# Altium project MACH_THU.PrjPCB
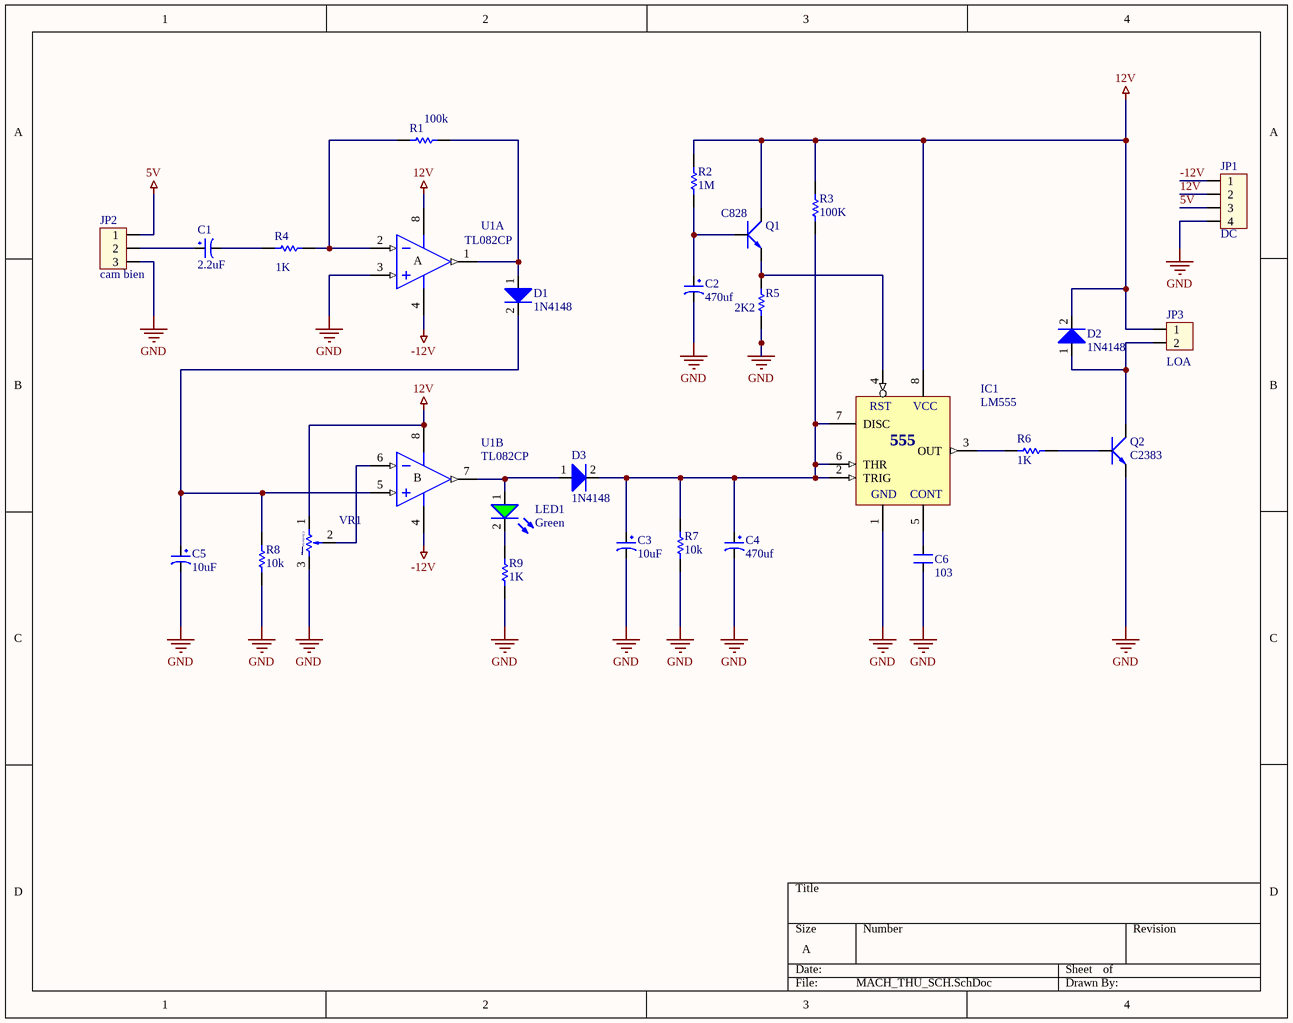
[diagram p0: MACH_THU_SCH.SchDoc]
1 sheet, 27 parts. Net scope: global (net labels, ports and power ports of the same name join across sheets).
Board file: mach_thu_pcb.PcbDoc

## Sheet MACH_THU_SCH.SchDoc
size A

### Parts
C1  2.2uF  [CAP_2_2UF_50V]
C2  470uf  [CAP_470UF_50V]
C3  10uF  [CAP_2_2UF_50V]
C4  470uf  [CAP_470UF_50V]
C5  10uF  [CAP_2_2UF_50V]
C6  103  [Tu gom 104]
D1  1N4148  [1N4148]
D2  1N4148  [1N4148]
D3  1N4148  [1N4148]
IC1  LM555  [LM555]
JP1  DC  [CON4]
JP2  cam bien  [SS8550]
JP3  LOA  [SPEAKER]
LED1  value Green  [LED3G]  (hidden comment: LED_G_3)
Q1  C828  [SS8550]
Q2  C2383  [SS8050]
R1  value 100k  [CFR25S]  (hidden comment: Res1/4W)
R2  value 1M  [CFR25S]  (hidden comment: Res1/4W)
R3  value 100K  [CFR25S]  (hidden comment: Res1/4W)
R4  value 1K  [CFR25S]  (hidden comment: Res1/4W)
R5  value 2K2  [CFR25S]  (hidden comment: Res1/4W)
R6  value 1K  [CFR25S]  (hidden comment: Res1/4W)
R7  value 10k  [CFR25S]  (hidden comment: Res1/4W)
R8  value 10k  [CFR25S]  (hidden comment: Res1/4W)
R9  value 1K  [CFR25S]  (hidden comment: Res1/4W)
U1  TL082CP  [DIP8]  (parts A,B of 2)
VR1  3306F-1-203  [VR POT 2]  (value not drawn)

### Nets
5V: JP1.3 JP2.1
12V: D2.2(K) IC1.8(VCC) JP1.2 JP3.1 Q1.2(C) R2.2 R3.2 U1.8(V+) VR1.1(CCW)
-12V: JP1.1 U1.4(V-)
GND: C2.2 C3.2 C4.2 C5.2 C6.1 IC1.1(GND) JP1.4 JP2.3 Q2.1(E) R5.1 R7.1 R8.1 R9.1 U1.3(IN+) VR1.3(CW)
NetC1_1: C1.1 JP2.2
NetC1_2: C1.2 R4.1
NetC2_1: C2.1 Q1.3(B) R2.1
NetC3_1: C3.1 C4.1 D3.2(K) IC1.2(TRIG) IC1.6(THR) IC1.7(DISC) R3.1 R7.2
NetC5_1: C5.1 D1.2(K) R8.2 U1.5(IN+)
NetC6_2: C6.2 IC1.5(CONT)
NetD1_1: D1.1(A) R1.2 U1.1(OUT)
NetD2_1: D2.1(A) JP3.2 Q2.2(C)
NetD3_1: D3.1(A) LED1.1(A) U1.7(OUT)
NetIC1_3: IC1.3(OUT) R6.2
NetIC1_4: IC1.4(RST) Q1.1(E) R5.2
NetLED1_2: LED1.2(K) R9.2
NetQ2_3: Q2.3(B) R6.1
NetR1_1: R1.1 R4.2 U1.2(IN-)
NetU1_6: U1.6(IN-) VR1.2(WIPER)

### Notes on the sheet
- (in symbol 3306F-1-203) Clockwise
- (in symbol LM555) 555
- (in symbol TL082CP, part A) A
- (in symbol TL082CP, part B) B

### Library data of the parts
C1 C3 C5 = CP1: Cap P  0,1uF < 22uF , 16 - 50V; Value: 10uF/50V; Description 1: 10 => 220uF/6,3V/10V - 10uF => 100uF/16V; Description 2: 0,1uF => 33uF/50V - 10uF => 22uF/63V; Description 3: 0,47uF => 10uF/100V
C2 C4 = CP3: Cap 100uF/35V - 470uF/16V; Value: 100uF/35V/50V; Description 1: 1000uF/6,3V - 470uF/16V - 330uF - 25V; Description 2: 220uF/35V - 100uF/50V - 63V - 4,7uF/200V; Description 3: 22uF => 33uF100V - 3,3uF => 4,7uF/250V; Description 4: 2,2uF =>3,3uF/350 - 2,2uF/400V - 1uF/450V
C6 = CN1.5: Cap np 682pF => 104pF; Value: 0.01uF
D1-D3 = 1N4148: Diode HS 200mA 100V DO-35; ComponentLink1Description: Datasheet; ComponentLink1URL: D:\Dropbox\Datasheets\Diodes and Rectifiers\Diodes\1N4148.pdf; Unit Price: 0.0038
IC1 = LM555: Timer; Value: LM555
JP1 = Con4: Connector 4; Value: Connector 4
JP2 = Con3: Connector 3; Value: Connector 3
JP3 = Con2: Connector 2; Value: Connector 2
LED1 = LED_GREEN_3MM: LED Green 3mm; ComponentLink1Description: Datasheet; ComponentLink1URL: D:\Dropbox\Datasheets\Opto and Illumination\LEDs\SMD LED.pdf; Unit Price: 0.0476
Q1 Q2 = C1815: NPN 600mW, ECB; Value: C1815
R1-R9 = Res1/4W: Resistor; Published: 8-Jun-2000; LatestRevisionDate: 17-Jul-2002; LatestRevisionNote: Re-released for DXP Platform.; PackageReference: AXIAL-0.3; Publisher: Altium Limited; PackageDescription: Axial Device, Thru-Hole; 2 Leads; 0.3 in Pin Spacing
U1 = TL082CP: JFET-Input Operational Amplifier 18V 3MHz; ComponentLink1Description: Datasheet; ComponentLink1URL: D:\Dropbox\Datasheets\Analog and Linear\Operational Amplifiers\TL082.pdf; Unit Price: 0.2500
VR1 = 3306F-1-203: VAR RES VR3306F 1/5W 20K; ComponentLink1Description: Datasheet; ComponentLink1URL: D:\Dropbox\Datasheets\Passive Components\Resistors\Trimming Potentiometer 3306.pdf; Unit Price: 0.0476